# Altium project ServoDecoder.PrjPCB
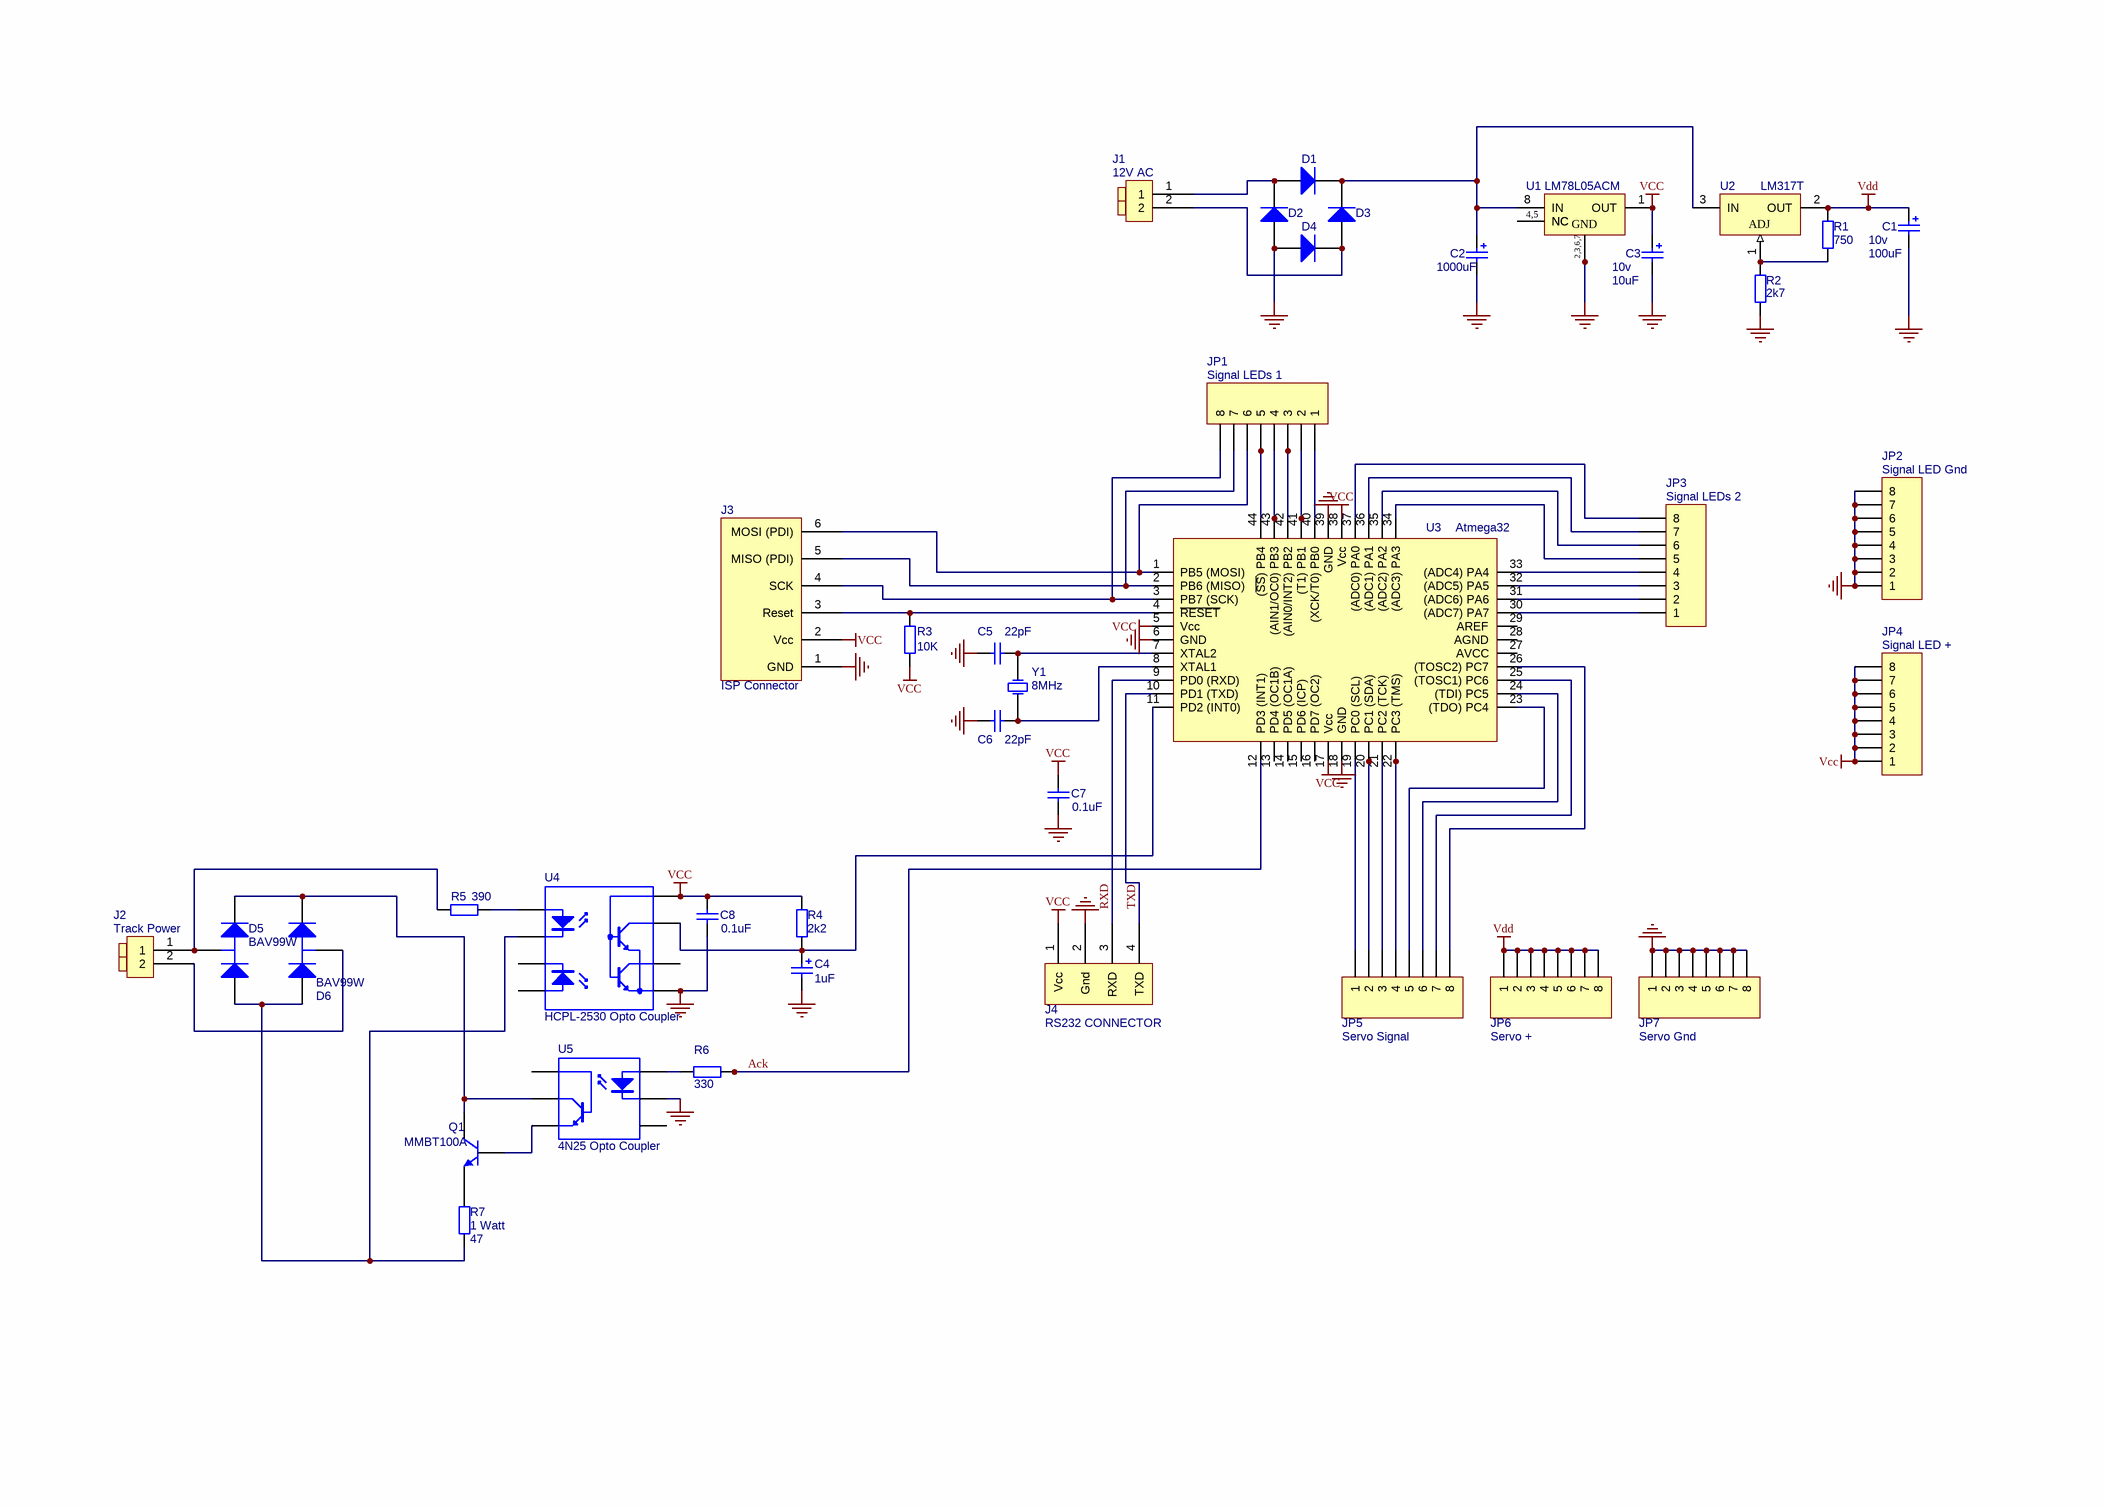
[diagram p0: ServoDecoder.SchDoc]
1 sheet, 39 parts. Net scope: global (net labels, ports and power ports of the same name join across sheets).

## Sheet ServoDecoder.SchDoc
size A3; PageSetup: Record=PageOptions|CenterHorizontal=True|CenterVertical=True|PrintScale=0.73|XCorrection=1.00|YCorrection=1.00|PrintKind=2|BorderSize=5000000|LeftOffset=0|BottomOffset=0|Orientation=2|PaperLength=1000|PaperWidth=1000|Scale=100|PaperSource=7|PrintQuality=-4|MediaType=1|DitherType=10|PaperKind=A4 [210x297mm]|PrintScaleMode=1

### Parts
C1  10v  value 100uF  [TC6032-2412]
C2  value 1000uF  [CAPPR5-10X10.5]  (hidden comment: Cap Pol1)
C3  10v  value 10uF  [CC3216-1206]
C4  value 1uF  [CC3216-1206]  (hidden comment: Cap Pol1)
C5  value 22pF  [CC2012-0805]  (hidden comment: Cap)
C6  value 22pF  [CC2012-0805]  (hidden comment: Cap)
C7  value 0.1uF  [CC2012-0805]  (hidden comment: Cap)
C8  value 0.1uF  [CC2012-0805]  (hidden comment: Cap)
D1  Diode 1N4004  [DIO10.46-5.3x2.8]  (value not drawn)
D2  Diode 1N4004  [DIO10.46-5.3x2.8]  (value not drawn)
D3  Diode 1N4004  [DIO10.46-5.3x2.8]  (value not drawn)
D4  Diode 1N4004  [DIO10.46-5.3x2.8]  (value not drawn)
D5  BAV99W  [SOT-323]
D6  BAV99W  [SOT-323]
J1  12V AC  [Screw Terminal 2 way 0.2]
J2  Track Power  [Screw Terminal 2 way 0.2]
J3  ISP Connector  [0.1 SIP 6 PIN]
J4  RS232 CONNECTOR  [0.1 SIP 4 PIN]
JP1  Signal LEDs 1  [HDR2X4]
JP2  Signal LED Gnd  [HDR1X8]
JP3  Signal LEDs 2  [HDR2X4]
JP4  Signal LED +  [HDR1X8]
JP5  Servo Signal  [HDR1X8]
JP6  Servo +  [HDR1X8]
JP7  Servo Gnd  [HDR1X8]
Q1  MMBT100A  [SO-G3]
R1  value 750  [AXIAL-0.3]  (hidden comment: Res2)
R2  value 2k7  [AXIAL-0.3]  (hidden comment: Res2)
R3  value 10K  [CR2012-0805]  (hidden comment: Res2)
R4  value 2k2  [CR2012-0805]  (hidden comment: Res2)
R5  value 390  [CR2012-0805]  (hidden comment: Res2)
R6  value 330  [CR2012-0805]  (hidden comment: Res2)
R7  1 Watt  value 47  [AXIAL-0.6]
U1  LM78L05ACM  [M08A]
U2  LM317T  [TO-3 with HS Clip]
U3  Atmega32  [44A]
U4  HCPL-2530 Opto Coupler  [8P3]
U5  4N25 Opto Coupler  [DIP6]
Y1  value 8MHz  [RAD-0.2]  (hidden comment: XTAL)

### Nets
GND: C1.2 C2.2 C3.2 C4.2 C5.1 C6.1 C7.1 C8.1 D2.1(A) D4.1(A) J3.1(GND) J4.2(Gnd) JP2.1 JP2.2 JP2.3 JP2.4 JP2.5 JP2.6 JP2.7 JP2.8 JP7.1 JP7.2 JP7.3 JP7.4 JP7.5 JP7.6 JP7.7 JP7.8 R2.1 U1.2(GND) U1.3(GND) U1.6(GND) U1.7(GND) U3.6(GND) U3.18(GND) U3.39(GND) U4.5(E) U5.2(K)
VCC: C3.1 C7.2 C8.2 J3.2(Vcc) J4.1(Vcc) JP4.1 JP4.2 JP4.3 JP4.4 JP4.5 JP4.6 JP4.7 JP4.8 R3.1 R4.1 U1.1(OUT) U3.5(Vcc) U3.17(Vcc) U3.38(Vcc) U4.8(E)
Vdd: C1.1 JP6.1 JP6.2 JP6.3 JP6.4 JP6.5 JP6.6 JP6.7 JP6.8 R1.2 U2.2(OUT)
Ack: R6.2 U3.12(PD3_(INT1))
RXD: J4.3(RXD) U3.9(PD0_(RXD))
TXD: J4.4(TXD) U3.10(PD1_(TXD))
NetC2_1: C2.1 D1.2(K) D3.2(K) U1.8(IN) U2.3(IN)
NetC4_1: C4.1 R4.2 U3.11(PD2_(INT0)) U4.7(C)
NetC5_2: C5.2 U3.7(XTAL2) Y1.2(OSC2)
NetC6_2: C6.2 U3.8(XTAL1) Y1.1(OSC1)
NetD1_1: D1.1(A) D2.2(K) J1.1
NetD3_1: D3.1(A) D4.2(K) J1.2
NetD5_1: D5.1(A) D6.1(A) R7.2 U4.2(K)
NetD5_2: D5.2(K) D6.2(K) Q1.3(C) U5.5(C)
NetD5_3: D5.3(C) J2.1 R5.2
NetD6_3: D6.3(C) J2.2
NetJ3_3: J3.3(Reset) R3.2 U3.4(~{RESET})
NetJ3_4: J3.4(SCK) JP1.8 U3.3(PB7_(SCK))
NetJ3_5: J3.5(MISO_(PDI)) JP1.7 U3.2(PB6_(MISO))
NetJ3_6: J3.6(MOSI_(PDI)) JP1.6 U3.1(PB5_(MOSI))
NetJP1_1: JP1.1 U3.40((XCK/T0)_PB0)
NetJP1_2: JP1.2 U3.41((T1)_PB1)
NetJP1_3: JP1.3 U3.42((AIN0/INT2)_PB2)
NetJP1_4: JP1.4 U3.43((AIN1/OC0)_PB3)
NetJP1_5: JP1.5 U3.44((~{SS})_PB4)
NetJP3_1: JP3.1 U3.30((ADC7)_PA7)
NetJP3_2: JP3.2 U3.31((ADC6)_PA6)
NetJP3_3: JP3.3 U3.32((ADC5)_PA5)
NetJP3_4: JP3.4 U3.33((ADC4)_PA4)
NetJP3_5: JP3.5 U3.34((ADC3)_PA3)
NetJP3_6: JP3.6 U3.35((ADC2)_PA2)
NetJP3_7: JP3.7 U3.36((ADC1)_PA1)
NetJP3_8: JP3.8 U3.37((ADC0)_PA0)
NetJP5_1: JP5.1 U3.19(PC0_(SCL))
NetJP5_2: JP5.2 U3.20(PC1_(SDA))
NetJP5_3: JP5.3 U3.21(PC2_(TCK))
NetJP5_4: JP5.4 U3.22(PC3_(TMS))
NetJP5_5: JP5.5 U3.23((TDO)_PC4)
NetJP5_6: JP5.6 U3.24((TDI)_PC5)
NetJP5_7: JP5.7 U3.25((TOSC1)_PC6)
NetJP5_8: JP5.8 U3.26((TOSC2)_PC7)
NetQ1_1: Q1.1(B) U5.4(E)
NetQ1_2: Q1.2(E) R7.1
NetR1_1: R1.1 R2.2 U2.1(ADJ)
NetR5_1: R5.1 U4.1(A)
NetR6_1: R6.1 U5.1(K)
NetU1_4: U1.4(NC) U1.5(NC)

Not connected (* = marked no-connect by the designer): U3 13(PD4_(OC1B)) 14(PD5_(OC1A)) 15(PD6_(ICP)) 16(PD7_(OC2)) 27(AVCC) 28(AGND) 29(AREF); U4 3(K) 4(A) 6(C); U5 3(N/C) 6(B)

### Notes on the sheet
- (in symbol LM78L05ACM) 4,5; 2,3,6,7

### Library data of the parts
C1-C4 = Cap Pol1: Polarized Capacitor (Radial); Published: 8-Jun-2000; Revision: July-2002: Re-released for DXP Platform.; Publisher: Altium Limited
C5-C8 = Cap: Capacitor; Published: 8-Jun-2000; Revision: July-2002: Re-released for DXP Platform.; Publisher: Altium Limited
D1-D4 = Diode 1N4004: 1 Amp General Purpose Rectifier; Revision 1: 11-Jul-2000: SIM Model Added.; Revision 2: 17-Jul-2002: Re-released for DXP Platform.; Package Information: Latest Revision: Aug-1999; Code - JEDEC: DO-204-AL; Published: 8-Jun-2000; Datasheet: Latest Revision: 1998; Package Reference: DO-41; Publisher: Altium Limited
D5 D6 = BAV99W: Silicon Switching Diode Array for High-Speed Switching; Package Information: Latest Revision: Sep-2001; Published: 21-Mar-2003; Datasheet: Latest Revision: Oct-1999; Package Reference: SOT-323; Publisher: Altium Limited
J1 J2 = Screw Terminal 2 Way
JP1-JP7 = Header 8: Header, 8-Pin; Revision: 17-Jul-2002: Re-released for DXP Platform.; Publisher: Altium Limited
Q1 = MMBT100A: General Purpose Amplifier NPN Silicon; Package Information: Latest Revision: 1997; Published: 29-Sep-2000; Revision: 17-Jul-2002: Re-released for DXP Platform.; Datasheet: Latest Revision: 1996; Package Reference: 318-08; Publisher: Altium Limited
R1-R7 = Res2: Resistor; Published: 8-Jun-2000; Revision: July-2002: Re-released for DXP Platform.; Publisher: Altium Limited
U1 = LM78L05ACM: 3-Terminal Positive Regulator; Package Information: Latest Revision: Sep-1997; Code - JEDEC: MS-012-AA; Code - IPC: SO8; Published: 15-Apr-2002; Revision: 17-Sep-2003: Changed SIM name.; Datasheet: Latest Revision: Sep-1999; Package Reference: M08A; Publisher: Altium Limited
U2 = LM317T: 3-Terminal Adjustable Regulator; Package Information: Latest Revision: 1995; Published: 15-Apr-2002; Datasheet: Latest Revision: Aug-1999; Package Reference: T03B; Publisher: Altium Limited
U3 = atmega32 (tfqp)
U4 = HCPL-2530
U5 = 4N25
Y1 = XTAL: Crystal Oscillator; Published: 8-Jun-2000; Revision: July-2002: Re-released for DXP Platform.; Publisher: Altium Limited